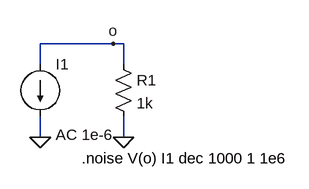
[diagram p0: schematic ejemplo1.asc]
ejemplo1.asc, the LTspice schematic file:
Version 4
SHEET 1 880 680
WIRE 64 96 -48 96
WIRE 80 96 64 96
WIRE -48 128 -48 96
WIRE 80 128 80 96
WIRE -48 240 -48 208
WIRE 80 240 80 208
FLAG 80 240 0
FLAG -48 240 0
FLAG 64 96 o
SYMBOL res 64 112 R0
SYMATTR InstName R1
SYMATTR Value 1k
SYMBOL current -48 128 R0
WINDOW 123 24 108 Left 2
WINDOW 39 0 0 Left 0
SYMATTR InstName I1
SYMATTR Value ""
SYMATTR Value2 AC 1e-6
TEXT 16 272 Left 2 !.noise V(o) I1 dec 1000 1 1e6

The netlist it stands for:
* ejemplo1.asc
R1 o 0 1k
I1 o 0 AC 1e-6
.noise V(o) I1 dec 1000 1 1e6
.backanno
.end